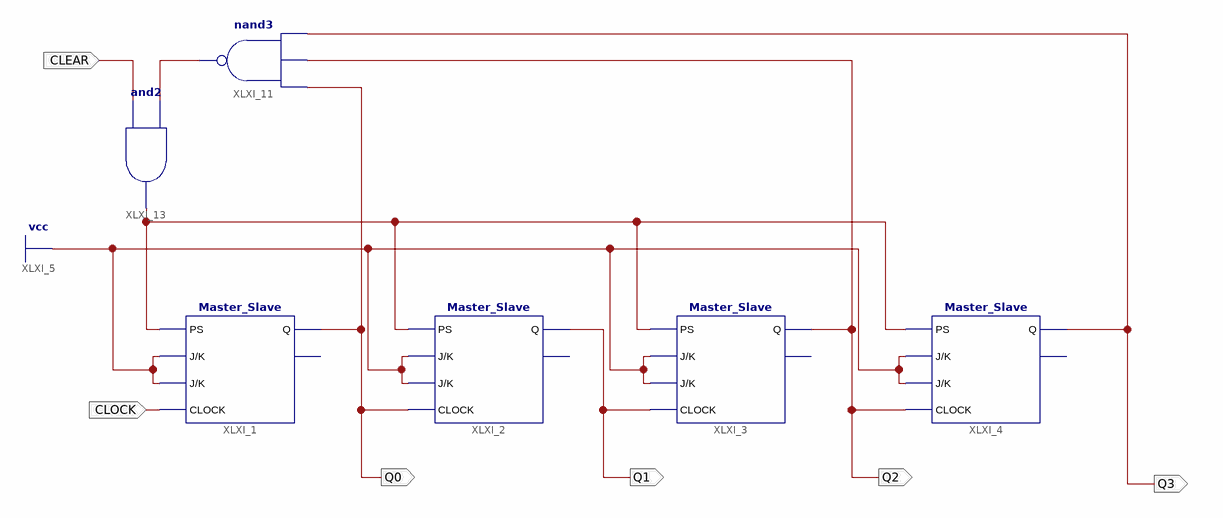
[diagram p0: schematic sheet 1]
// Xilinx ISE schematic MOD_13_UP_COUNTER.sch (artix7) as structural Verilog: 6 symbols, 6 ports
module MOD_13_UP_COUNTER (
  input  CLEAR,
  input  CLOCK,
  output Q0,
  output Q1,
  output Q2,
  output Q3
);

  wire XLXN_19, XLXN_26;

  Master_Slave XLXI_4 (.CLOCK(Q2), .J(1'b1), .K(1'b1), .PS(XLXN_26), .Q(Q3));  // open: Qb
  Master_Slave XLXI_3 (.CLOCK(Q1), .J(1'b1), .K(1'b1), .PS(XLXN_26), .Q(Q2));  // open: Qb
  Master_Slave XLXI_2 (.CLOCK(Q0), .J(1'b1), .K(1'b1), .PS(XLXN_26), .Q(Q1));  // open: Qb
  Master_Slave XLXI_1 (.CLOCK(CLOCK), .J(1'b1), .K(1'b1), .PS(XLXN_26), .Q(Q0));  // open: Qb
  nand XLXI_11 (XLXN_19, Q3, Q2, Q0);
  and XLXI_13 (XLXN_26, CLEAR, XLXN_19);
endmodule
